# Altium schematic sheet PA-TDA74982.0.SchDoc
size A3
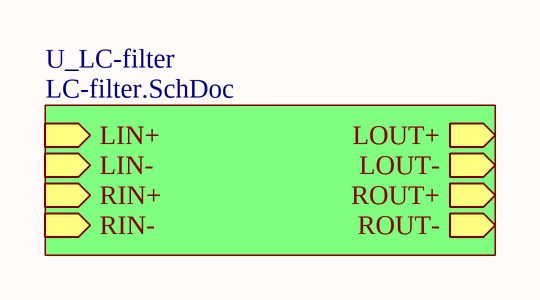
[diagram p0: PA-TDA74982.0.SchDoc]

## Sub-sheets
U_LC-filter = LC-filter.SchDoc: LIN+ (in), LIN- (in), LOUT+ (out), LOUT- (out), RIN+ (in), RIN- (in), ROUT+ (out), ROUT- (out)